# EAGLE design avr-led-taster (EAGLE 5.11)
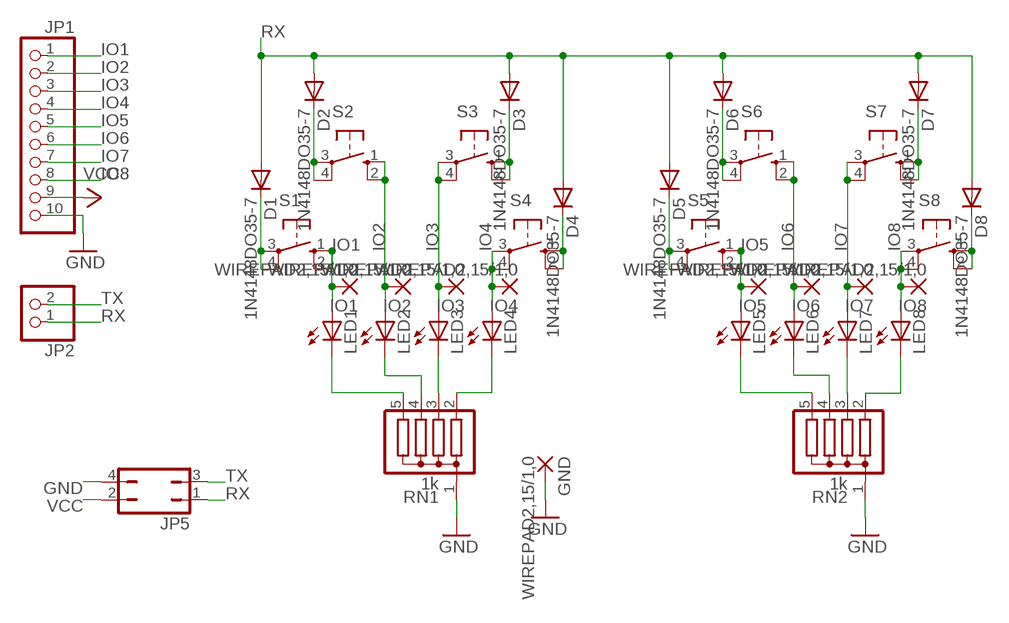
[diagram p0: schematic, sheet 1]

## Parts
D1  1N4148DO35-7  [DO35-7]
D2  1N4148DO35-7  [DO35-7]
D3  1N4148DO35-7  [DO35-7]
D4  1N4148DO35-7  [DO35-7]
D5  1N4148DO35-7  [DO35-7]
D6  1N4148DO35-7  [DO35-7]
D7  1N4148DO35-7  [DO35-7]
D8  1N4148DO35-7  [DO35-7]
GND  WIREPAD2,15/1,0  [2,15/1,0]
IO1  WIREPAD2,15/1,0  [2,15/1,0]
IO2  WIREPAD2,15/1,0  [2,15/1,0]
IO3  WIREPAD2,15/1,0  [2,15/1,0]
IO4  WIREPAD2,15/1,0  [2,15/1,0]
IO5  WIREPAD2,15/1,0  [2,15/1,0]
IO6  WIREPAD2,15/1,0  [2,15/1,0]
IO7  WIREPAD2,15/1,0  [2,15/1,0]
IO8  WIREPAD2,15/1,0  [2,15/1,0]
JP1  PINHD-1X10  [1X10]
JP2  PINHD-1X2  [1X02]
JP5  JP2Q  [JP2Q]
LED1  LED3MM  [LED3MM]
LED2  LED3MM  [LED3MM]
LED3  LED3MM  [LED3MM]
LED4  LED3MM  [LED3MM]
LED5  LED3MM  [LED3MM]
LED6  LED3MM  [LED3MM]
LED7  LED3MM  [LED3MM]
LED8  LED3MM  [LED3MM]
RN1  1k  G04R  [SIL5]
RN2  1k  G04R  [SIL5]
S1  10-XX  [B3F-10XX]
S2  10-XX  [B3F-10XX]
S3  10-XX  [B3F-10XX]
S4  10-XX  [B3F-10XX]
S5  10-XX  [B3F-10XX]
S6  10-XX  [B3F-10XX]
S7  10-XX  [B3F-10XX]
S8  10-XX  [B3F-10XX]

## Nets
GND: GND.1(P) JP1.10 JP5.4 RN1.1 RN2.1
IO1: IO1.1(P) JP1.1 LED1.A S1.1(S) S1.2(S1)
IO2: IO2.1(P) JP1.2 LED2.A S2.1(S) S2.2(S1)
IO3: IO3.1(P) JP1.3 LED3.A S3.3(P) S3.4(P1)
IO4: IO4.1(P) JP1.4 LED4.A S4.3(P) S4.4(P1)
IO5: IO5.1(P) JP1.5 LED5.A S5.1(S) S5.2(S1)
IO6: IO6.1(P) JP1.6 LED6.A S6.1(S) S6.2(S1)
IO7: IO7.1(P) JP1.7 LED7.A S7.3(P) S7.4(P1)
IO8: IO8.1(P) JP1.8 LED8.A S8.3(P) S8.4(P1)
N$1: LED1.K(C) RN1.5
N$2: LED2.K(C) RN1.4
N$3: LED7.K(C) RN2.3
N$4: LED4.K(C) RN1.2
N$5: LED5.K(C) RN2.5
N$6: LED6.K(C) RN2.4
N$7: LED3.K(C) RN1.3
N$8: LED8.K(C) RN2.2
N$11: D3.C S3.1(S) S3.2(S1)
N$12: D4.C S4.1(S) S4.2(S1)
N$13: D2.C S2.3(P) S2.4(P1)
N$14: D1.C S1.3(P) S1.4(P1)
N$15: D6.C S6.3(P) S6.4(P1)
N$16: D5.C S5.3(P) S5.4(P1)
N$17: D7.C S7.1(S) S7.2(S1)
N$18: D8.C S8.1(S) S8.2(S1)
RX: D1.A D2.A D3.A D4.A D5.A D6.A D7.A D8.A JP2.1 JP5.1
TX: JP2.2 JP5.3
VCC: JP1.9 JP5.2

## Library data of the parts
D1-D8 = diode:1N4148: DIODE high speed (Philips)
GND IO1-IO8 = wirepad:WIREPAD: Wire PAD connect wire on PCB
JP1 = pinhead:PINHD-1X10: PIN HEADER
JP2 = pinhead:PINHD-1X2: PIN HEADER
JP5 = jumper:JP2Q: JUMPER
LED1-LED8 = led:LED: LED OSRAM: - CHIPLED LG R971, LG N971, LY N971, LG Q971, LY Q971, LO R971, LY R971 LH N974, LH R974 LS Q976, LO Q976, LY Q976 LO Q996 - Hyper CHIPLED LW Q18S LB Q993, LB Q99A, LB R99A - SideLED LS A670, LO A670, LY A670, LG A670, LP A670 LB A673, LV A673, LT A673, LW A673 LH A674 LY A675 LS A676, LA A676, LO A676, LY A676, LW A676 LS A679, LY A679, LG A679 - Hyper Micro SIDELED® LS Y876, LA Y876, LO Y876, LY Y876 LT Y87S - SmartLED LW L88C, LW L88S LB L89C, LB L89S, LG L890 LS L89K, LO L89K, LY L89K LS L896, LA L896, LO L896, LY L896 - TOPLED LS T670, LO T670, LY T670, LG T670, LP T670 LSG T670, LSP T670, LSY T670, LOP T670, LYG T670 LG T671, LOG T671, LSG T671 LB T673, LV T673, LT T673, LW T673 LH T674 LS T676, LA T676, LO T676, LY T676, LB T676, LH T676, LSB T676, LW T676 LB T67C, LV T67C, LT T67C, LS T67K, LO T67K, LY T67K, LW E67C LS E67B, LA E67B, LO E67B, LY E67B, LB E67C, LV E67C, LT E67C LW T67C LS T679, LY T679, LG T679 LS T770, LO T770, LY T770, LG T770, LP T770 LB T773, LV T773, LT T773, LW T773 LH T774 LS E675, LA E675, LY E675, LS T675 LS T776, LA T776, LO T776, LY T776, LB T776 LHGB T686 LT T68C, LB T68C - Hyper Mini TOPLED® LB M676 - Mini TOPLED Santana® LG M470 LS M47K, LO M47K, LY M47K Source: http://www.osram.convergy.de LUXEON: - LUMILED® LXK2-PW12-R00, LXK2-PW12-S00, LXK2-PW14-U00, LXK2-PW14-V00 LXK2-PM12-R00, LXK2-PM12-S00, LXK2-PM14-U00 LXK2-PE12-Q00, LXK2-PE12-R00, LXK2-PE12-S00, LXK2-PE14-T00, LXK2-PE14-U00 LXK2-PB12-K00, LXK2-PB12-L00, LXK2-PB12-M00, LXK2-PB14-N00, LXK2-PB14-P00, LXK2-PB14-Q00 LXK2-PR12-L00, LXK2-PR12-M00, LXK2-PR14-Q00, LXK2-PR14-R00 LXK2-PD12-Q00, LXK2-PD12-R00, LXK2-PD12-S00 LXK2-PH12-R00, LXK2-PH12-S00 LXK2-PL12-P00, LXK2-PL12-Q00, LXK2-PL12-R00 Source: www.luxeon.com KINGBRIGHT: KA-3528ASYC Source: www.kingbright.com
RN1 RN2 = resistor-sil:G04R: SIL RESISTOR
S1-S8 = switch-omron:10-XX: OMRON SWITCH

## Net classes
0 default: width 0.406 mm

## Board
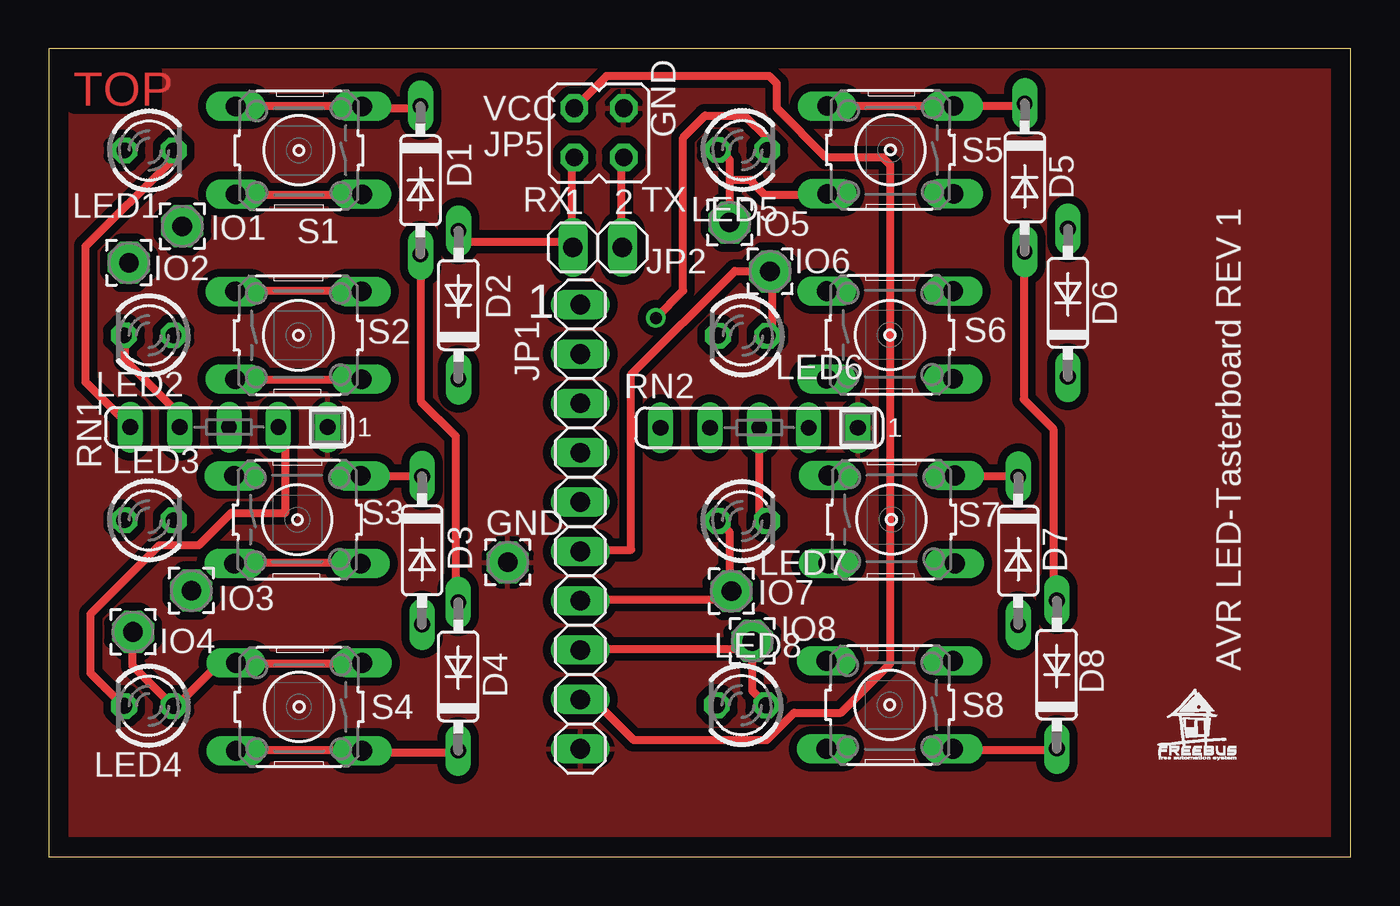
[diagram p1: board, top side]
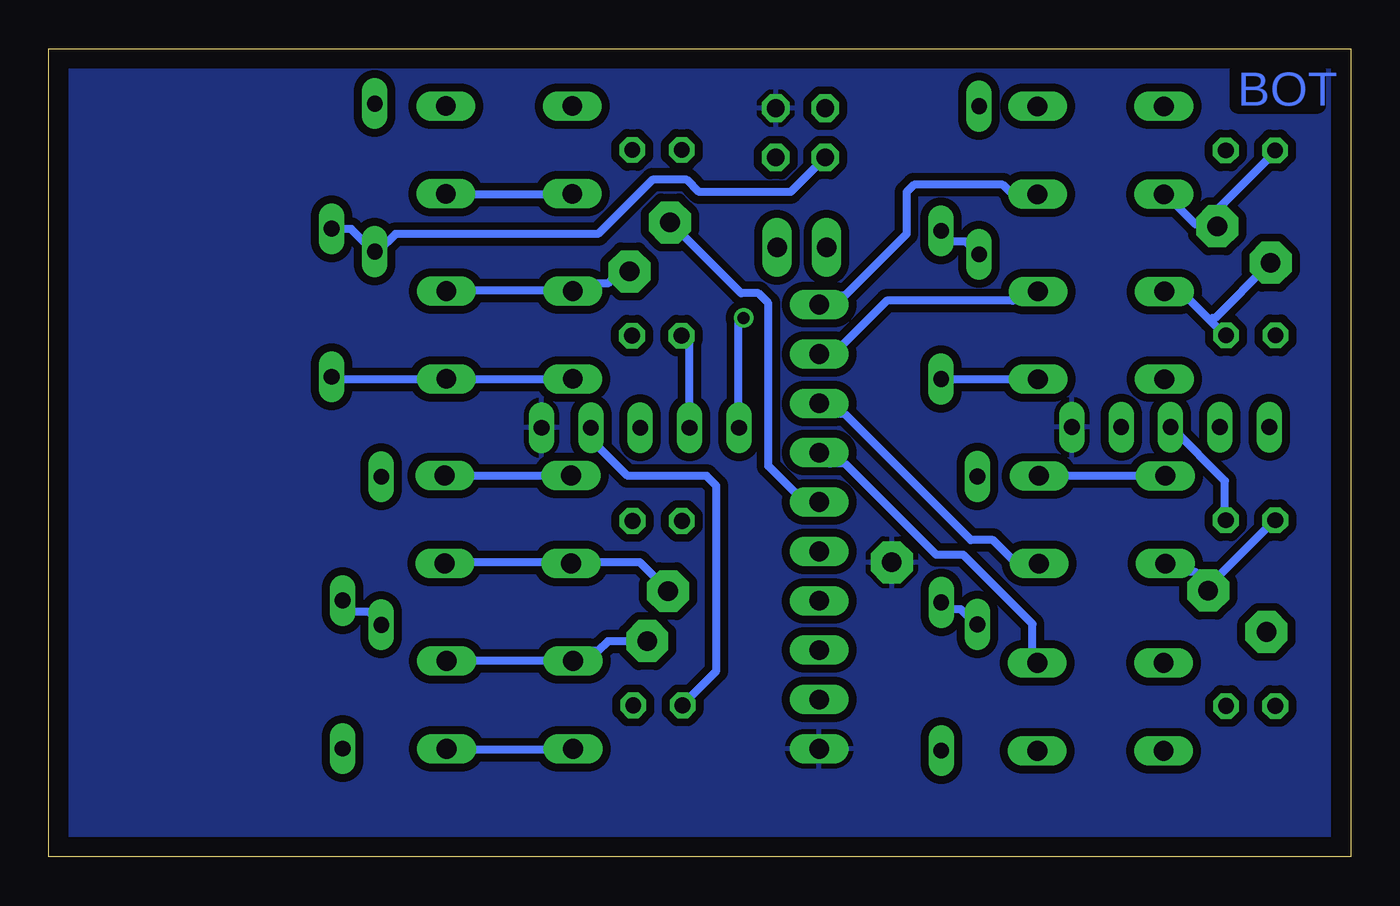
[diagram p2: board, bottom side, seen from below]

Size 67 x 41.6 mm. Coordinates in mm from the lower left corner, seen from the top.
Outline: 0,0 67,0 67,41.6 0,41.6 0,0
Copper layers (1*16): Top 0.035mm / dielectric 1.5mm / Bottom 0.035mm
Design rules "default *": minimum track width 10mil, minimum drill 24mil, track to track 16mil, track to pad 16mil, pad to pad 16mil, via to via 16mil, smd to smd 8mil, copper to edge 40mil, drill to drill 8mil, minimum pad ring 10mil, minimum via ring 8mil, stop-mask expansion 4mil, vias tented up to drill 0mil, thermal gap 10mil

### Footprints (pad centres in the part's own frame; a part is rotated, then mirrored left to right if it is on the bottom)
DO35-7 = drill 0.813 long: A 3.81,0; C -3.81,0
2,15/1,0 = drill 1.016 pad 2.159 octagon: 1 0,0
1X10 = drill 1.016 long: 1 -11.43,0; 2 -8.89,0; 3 -6.35,0; 4 -3.81,0; 5 -1.27,0; 6 1.27,0; 7 3.81,0; 8 6.35,0; 9 8.89,0; 10 11.43,0
1X02 = drill 1.016 long: 1 -1.27,0; 2 1.27,0
JP2Q = drill 0.914 octagon: 1 -1.27,-1.27; 2 -1.27,1.27; 3 1.27,-1.27; 4 1.27,1.27
LED3MM = drill 0.813 octagon: A -1.27,0; K 1.27,0
SIL5 = drill 0.813 long: 1 -5.08,0; 2 -2.54,0; 3 0,0; 4 2.54,0; 5 5.08,0
B3F-10XX = drill 1.016 long: 1 -3.251,2.261; 2 3.251,2.261; 3 -3.251,-2.261; 4 3.251,-2.261

### Placement (x,y rotation side)
D1  19.13,34.82 270 top
D2  21.09,28.41 90 top
D3  19.21,15.78 270 top
D4  21.08,9.29 90 top
D5  50.22,34.96 270 top
D6  52.44,28.52 90 top
D7  49.88,15.76 270 top
D8  51.87,9.39 90 top
GND  23.62,15.17 0 top
IO1  6.88,32.46 0 top
IO2  4.13,30.58 0 top
IO3  7.34,13.71 0 top
IO4  4.34,11.58 0 top
IO5  35.03,32.65 0 top
IO6  37.11,30.13 0 top
IO7  35.13,13.68 0 top
IO8  36.2,11.11 0 top
JP1  27.36,17 270 top
JP2  28.24,31.37 0 top
JP5  28.32,37.27 0 top
LED1  5.17,36.36 0 top
LED2  5.15,26.84 180 top
LED3  5.16,17.33 0 top
LED4  5.16,7.77 180 top
LED5  35.7,36.38 0 top
LED6  35.71,26.83 180 top
LED7  35.69,17.29 0 top
LED8  35.65,7.81 180 top
RN1  9.28,22.12 180 top
RN2  36.56,22.09 180 top
S1  12.88,36.36 180 top
S2  12.85,26.85 0 top
S3  12.8,17.36 0 top
S4  12.88,7.73 180 top
S5  43.31,36.39 180 top
S6  43.28,26.86 0 top
S7  43.37,17.37 0 top
S8  43.27,7.83 180 top
U$1  [FREEBUS_LOGO]  59.05,6.4 0 top

### Tracks (layer width: path | path; a pad name or v marks a point on that pad's centre or on a via)
GND
  pour Top: 0.05,41.56 66.95,41.56 66.95,0.05 0.05,0.05
  pour Bottom: 0.05,41.56 66.95,41.56 66.95,0.05 0.05,0.05
IO1
  Top 0.406: S1.1 16,34.09 9.65,34.09 S1.2
  Bottom 0.406: LED1.A 3.94,36.25 6.86,33.33 6.86,32.57 IO1.1 6.99,32.57 8,32.57 9.53,34.09 S1.2 | JP1.1 27.3,28.5 26.92,28.88 26.04,28.88 22.86,32.06 22.86,34.22 22.48,34.6 17.91,34.6 17.53,34.22 16.13,34.22 S1.1
IO2
  Top 0.406: S2.2 16,29.14 9.65,29.14 S2.1
  Bottom 0.406: 7.24,27.61 8.64,29.01 9.53,29.01 S2.1 | 7.24,27.61 6.48,26.85 LED2.A | JP1.2 27.3,25.96 26.92,26.34 26.16,26.34 23.88,28.63 17.4,28.63 17.02,29.01 16.13,29.01 S2.2 | IO2.1 4.19,30.53 6.99,27.74 7.11,27.74 7.24,27.61
IO3
  Top 0.406: S3.4 16,15.17 9.65,15.17 S3.3
  Bottom 0.406: LED3.A 3.94,17.33 7.24,14.02 7.24,13.77 IO3.1 7.37,14.15 7.49,14.15 8,14.66 9.14,14.66 9.53,15.04 S3.3 | JP1.3 26.8,22.79 26.04,22.79 19.56,16.31 18.41,16.31 17.27,15.17 16.13,15.17 S3.4
IO4
  Top 0.406: IO4.1 4.32,11.48 4.32,9.83 6.35,7.8 LED4.A 6.6,7.8 8.38,9.58 8.38,9.96 9.53,9.96 S4.4 9.78,9.96 16.13,9.96 S4.3
  Bottom 0.406: JP1.4 26.8,20.25 26.04,20.25 21.34,15.55 19.94,15.55 16.38,11.99 16.38,10.09 16.26,10.09 S4.3
IO5
  Top 0.406: 35.05,34.85 35.05,32.69 IO5.1 | 35.05,34.85 35.05,35.87 34.54,36.38 LED5.A | 35.05,34.85 36.2,34.85 36.2,34.72 36.83,34.09 40.01,34.09 S5.2
  Bottom 0.406: S5.1 46.48,34.09 40.13,34.09 S5.2 | JP1.5 27.81,18.72 28.57,18.72 29.97,20.12 29.97,28.5 30.48,29.01 31.37,29.01 34.92,32.57 IO5.1
IO6
  Top 0.406: LED6.A 37.08,26.85 37.21,26.98 37.21,30.03 IO6.1 36.96,30.15 35.31,30.15 29.97,24.82 29.97,15.8 27.43,15.8 JP1.6
  Bottom 0.406: IO6.1 37.21,30.03 37.72,30.03 38.23,29.52 39.62,29.52 40.01,29.14 S6.1 40.13,29.14 46.48,29.14 S6.2
IO7
  Top 0.406: JP1.7 27.43,13.26 35.05,13.26 35.05,13.52 IO7.1 35.05,13.77 35.05,16.69 34.54,17.2 LED7.A
  Bottom 0.406: S7.4 46.61,15.17 40.26,15.17 S7.3 40.01,15.17 36.58,15.17 35.18,13.77 IO7.1
IO8
  Top 0.406: LED8.A 36.83,7.93 36.2,8.56 IO8.1 36.07,10.72 27.43,10.72 JP1.8
  Bottom 0.406: IO8.1 36.32,11.1 38.23,11.1 38.73,10.6 39.62,10.6 40.01,10.21 S8.4 40.13,10.09 46.48,10.09 S8.3
N$1
  Top 0.406: RN1.5 4.19,22.15 1.91,24.44 1.91,31.42 6.35,35.87 6.35,36.25 LED1.K
N$2
  Top 0.406: RN1.4 6.73,22.15 6.35,22.53 6.35,23.17 3.94,25.58 3.94,26.72 LED2.K
N$3
  Top 0.406: LED7.K 36.96,17.33 36.58,17.71 36.58,22.03 RN2.3
N$4
  Top 0.406: LED4.K 3.81,7.8 2.16,9.45 2.16,12.5 5.71,16.06 7.75,16.06 9.4,17.71 12.19,17.71 12.19,21.01 11.94,21.26 11.94,22.03 RN1.2
N$5  (via drill 0.61)
  Top 0.406: v31.24,27.74 32.64,29.14 32.64,37.01 33.78,38.15 35.81,38.15 36.96,37.01 36.96,36.5 LED5.K
  Bottom 0.406: v31.24,27.74 31.5,27.74 31.5,22.15 RN2.5
N$6
  Bottom 0.406: RN2.4 34.04,22.15 34.04,26.72 34.42,26.72 LED6.K
N$7
  Bottom 0.406: LED3.K 6.48,17.45 6.48,19.36 9.14,22.03 9.27,22.03 RN1.3
N$8
  Bottom 0.406: LED8.K 34.29,7.93 32.64,9.58 32.64,19.1 33.15,19.61 37.21,19.61 38.99,21.39 38.99,22.03 RN2.2
N$11
  Top 0.406: D3.C 19.18,19.61 16.13,19.61 S3.2
  Bottom 0.406: S3.1 9.65,19.61 16,19.61 S3.2
N$12
  Top 0.406: D4.C 20.95,5.39 16.26,5.39 S4.1 16,5.51 9.65,5.51 S4.2
N$13
  Top 0.406: S2.3 9.65,24.57 16,24.57 S2.4
  Bottom 0.406: D2.C 21.08,24.57 16.13,24.57 S2.4
N$14
  Top 0.406: D1.C 19.05,38.53 16.13,38.53 S1.3 16,38.66 9.65,38.66 S1.4
N$15
  Bottom 0.406: D6.C 52.32,24.69 52.2,24.57 46.61,24.57 S6.4 46.35,24.57 40.13,24.57 S6.3
N$16
  Top 0.406: D5.C 50.16,38.66 46.61,38.66 S5.3 46.35,38.66 40.13,38.66 S5.4
N$17
  Top 0.406: D7.C 49.78,19.61 46.74,19.61 S7.2
  Bottom 0.406: S7.1 40.13,19.61 46.61,19.61 S7.2
N$18
  Top 0.406: D8.C 51.82,5.51 46.61,5.51 S8.1
  Bottom 0.406: S8.2 40.13,5.51 46.48,5.51 S8.1
RX
  Top 0.406: D8.A 51.82,13.26 51.69,13.39 51.69,22.03 50.16,23.55 50.16,31.04 D5.A | JP5.1 26.92,35.87 26.92,31.42 JP2.1 26.8,31.68 21.21,31.68 21.21,32.18 D2.A | D4.A 20.95,13.14 20.95,21.64 19.18,23.42 19.18,30.91 D1.A
  Bottom 0.406: D7.A 49.91,11.99 50.55,12.63 51.31,12.63 51.82,13.14 D8.A | D6.A 52.32,32.31 51.44,32.31 50.29,31.17 D5.A 50.04,31.17 49.15,32.06 38.73,32.06 35.94,34.85 34.16,34.85 33.53,34.22 28.83,34.22 JP5.1 | D3.A 19.3,11.99 20.07,12.75 20.7,12.75 20.95,13.01 D4.A | D1.A 19.18,31.04 19.81,31.68 20.57,31.68 21.08,32.18 D2.A
TX
  Top 0.406: JP5.3 29.46,35.87 29.46,31.42 JP2.2
VCC
  Top 0.406: JP5.2 28.7,40.19 37.08,40.19 37.47,39.8 37.47,38.53 40.01,35.99 42.93,35.99 43.31,35.61 43.31,9.96 40.77,7.42 38.35,7.42 36.96,6.02 30.1,6.02 28.07,8.06 27.43,8.06 JP1.9

### Text on the board
Top: TOP
Bottom: BOT
tNames: VCC | GND | RX | TX | 1 | AVR LED-Tasterboard REV 1